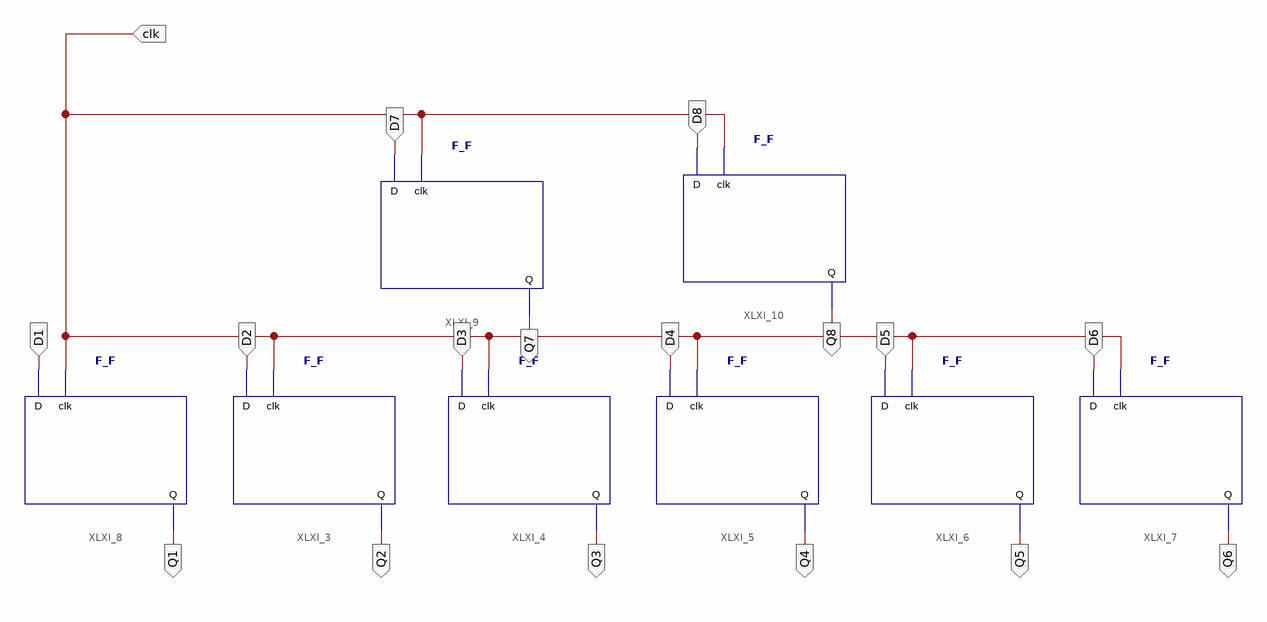
[diagram p0: schematic sheet 1]
// Xilinx ISE schematic MemorUnit.sch (spartan3a) as structural Verilog: 8 symbols, 17 ports
module MemorUnit (
  input  clk,
  input  D7,
  input  D8,
  input  D1,
  input  D2,
  input  D3,
  input  D4,
  input  D5,
  input  D6,
  output Q7,
  output Q8,
  output Q4,
  output Q3,
  output Q2,
  output Q1,
  output Q5,
  output Q6
);

  F_F XLXI_3 (.Q(Q2), .clk(clk), .D(D2));
  F_F XLXI_4 (.Q(Q3), .clk(clk), .D(D3));
  F_F XLXI_5 (.Q(Q4), .clk(clk), .D(D4));
  F_F XLXI_6 (.Q(Q5), .clk(clk), .D(D5));
  F_F XLXI_7 (.Q(Q6), .clk(clk), .D(D6));
  F_F XLXI_8 (.Q(Q1), .clk(clk), .D(D1));
  F_F XLXI_9 (.Q(Q7), .clk(clk), .D(D7));
  F_F XLXI_10 (.Q(Q8), .clk(clk), .D(D8));
endmodule
